# EAGLE design ESP32 UWB (EAGLE 6.6.0)
Assembly variants: No USB, Normal
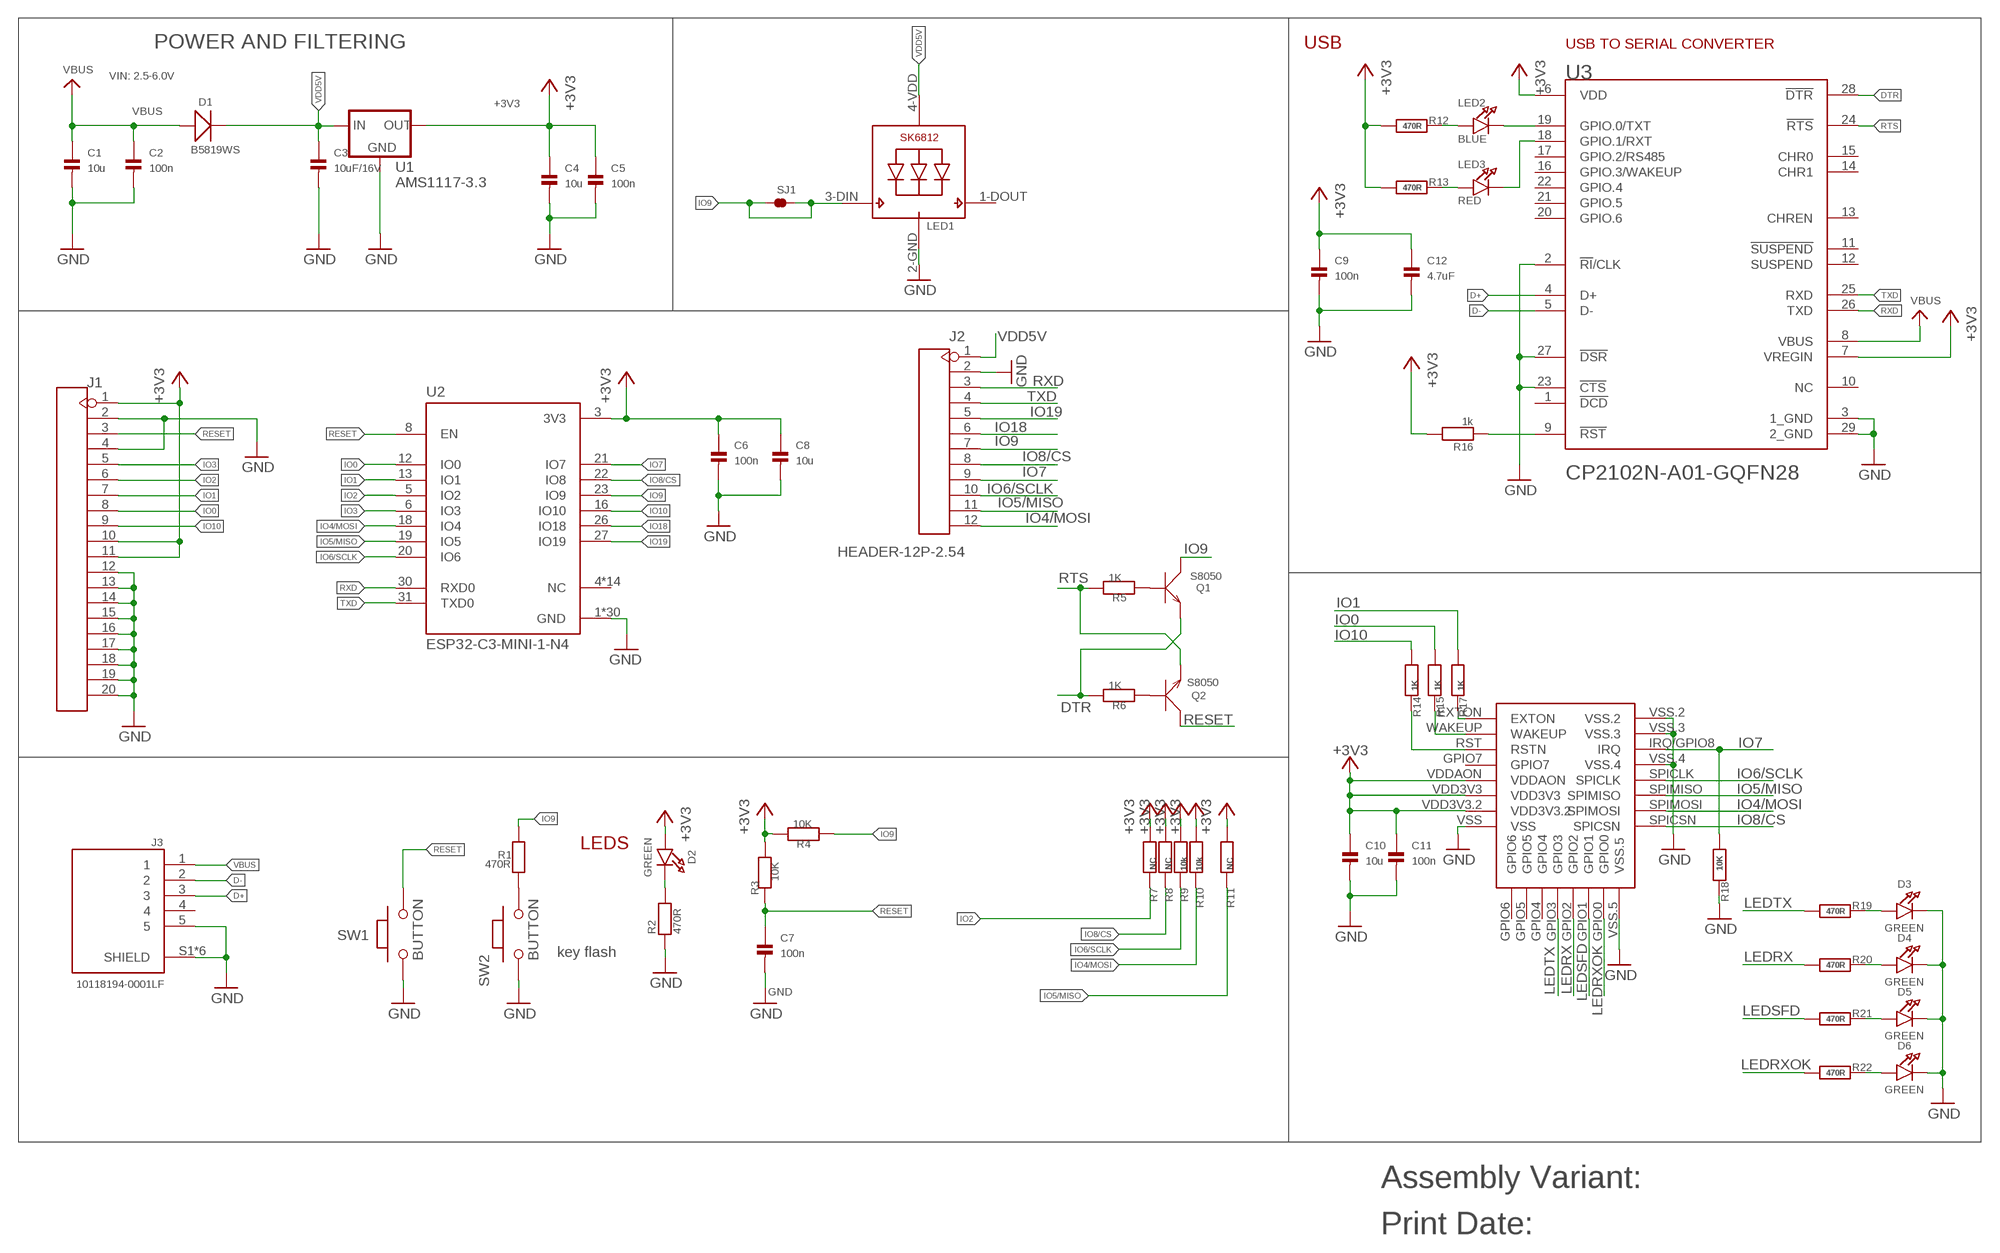
[diagram p0: schematic, sheet 1]

## Parts
C1  10u  CAP_CERAMIC0603  [0603]
C2  100n  CAP_CERAMIC0603  [0603]
C3  10uF/16V  CAP_CERAMIC0603  [0603]
C4  10u  CAP_CERAMIC0603  [0603]
C5  100n  CAP_CERAMIC0603  [0603]
C6  100n  CAP_CERAMIC0603  [0603]
C7  100n  CAP_CERAMIC0603  [0603]
C8  10u  CAP_CERAMIC0603  [0603]
C9  100n  CAP_CERAMIC0603  [0603]  (not fitted in variant No USB)
C10  10u  CAP_CERAMIC0603  [0603]
C11  100n  CAP_CERAMIC0603  [0603]
C12  4.7uF  CAP_CERAMIC0603  [0603]  (not fitted in variant No USB)
D1  B5819WS  D'0805'  [SOD323]
D2  GREEN  LED0805_NOOUTLINE  [CHIPLED_0805_NOOUTLINE]
D3  GREEN  LED0805_NOOUTLINE  [CHIPLED_0805_NOOUTLINE]
D4  GREEN  LED0805_NOOUTLINE  [CHIPLED_0805_NOOUTLINE]
D5  GREEN  LED0805_NOOUTLINE  [CHIPLED_0805_NOOUTLINE]
D6  GREEN  LED0805_NOOUTLINE  [CHIPLED_0805_NOOUTLINE]
J1  HEADER-20P-2.54  [20P-2.54]
J2  HEADER-12P-2.54  [12P-2.54]
J3  10118194-0001LF  [AMPHENOL_10118194-0001LF]
LED1  SK6812_3535  [LED3535]
LED2  BLUE  LED0603_NOOUTLINE  [CHIPLED_0603_NOOUTLINE]  (not fitted in variant No USB)
LED3  RED  LED0603_NOOUTLINE  [CHIPLED_0603_NOOUTLINE]  (not fitted in variant No USB)
Q1  S8050  TRANSISTOR-NPN-SOT23  [SOT23]  (not fitted in variant No USB)
Q2  S8050  TRANSISTOR-NPN-SOT23  [SOT23]  (not fitted in variant No USB)
R1  470R  RESISTOR0603  [0603]
R2  470R  RESISTOR0603  [0603]
R3  10K  RESISTOR0603  [0603]
R4  10K  RESISTOR0603  [0603]
R5  1K  RESISTOR0603  [0603]  (not fitted in variant No USB)
R6  1K  RESISTOR0603  [0603]  (not fitted in variant No USB)
R7  NC  RESISTOR0603  [0603]
R8  NC  RESISTOR0603  [0603]
R9  10k  RESISTOR0603  [0603]
R10  10k  RESISTOR0603  [0603]
R11  NC  RESISTOR0603  [0603]
R12  470R  RESISTOR0603  [0603]  (not fitted in variant No USB)
R13  470R  RESISTOR0603  [0603]  (not fitted in variant No USB)
R14  1K  RESISTOR0603  [0603]
R15  1K  RESISTOR0603  [0603]
R16  1k  RESISTOR0603  [0603]  (not fitted in variant No USB)
R17  1K  RESISTOR0603  [0603]
R18  10K  RESISTOR0603  [0603]
R19  470R  RESISTOR0603  [0603]
R20  470R  RESISTOR0603  [0603]
R21  470R  RESISTOR0603  [0603]
R22  470R  RESISTOR0603  [0603]
SJ1  SJS  [SJ_S]
SW1  BUTTON  PB157  [157SW]
SW2  BUTTON  PB157  [157SW]
U1  AMS1117-3.3  V_REG_MIC2920  [SOT223]
U2  ESP32-C3-MINI-1-N4  [XCVR_ESP32-C3-MINI-1-N4]
U3  SILICON_LABS_CP2102N-A01-GQFN28SILICON_LABS_CP2102N-A01-GQFN28_0_3  [SILICON_LABS_CP2102N-A01-GQFN28_3]  (not fitted in variant No USB)
U4  DWM1000  [DWM1000]

## Nets
+3V3: C4.1 C5.1 C6.1 C8.1 C9.1 C10.1 C11.1 C12.1 D2.A J1.1 J1.10 J1.11 R3.2 R4.2 R7.1 R8.1 R9.1 R10.1 R11.1 R12.1 R13.1 R16.2 U1.3(OUT) U2.3(3V3) U3.6(VDD) U3.7(VREGIN) U4.VDD3V3 U4.VDD3V3.2 U4.VDDAON
D+: J3.3 U3.4(D+)
D-: J3.2 U3.5(D-)
DTR: Q1.2(E) R6.2 U3.28(!DTR!)
GND: C1.2 C2.2 C3.2 C4.2 C5.2 C6.2 C7.2 C8.2 C9.2 C10.2 C11.2 C12.2 D3.C D4.C D5.C D6.C J1.2 J1.4 J1.12 J1.13 J1.14 J1.15 J1.16 J1.17 J1.18 J1.19 J1.20 J2.2 J3.5 J3.S1(SHIELD) J3.S2(SHIELD) J3.S3(SHIELD) J3.S4(SHIELD) J3.S5(SHIELD) J3.S6(SHIELD) LED1.2-GND(GND) R2.1 R18.2 SW1.1 SW2.1 U1.2(GND) U2.1(GND) U2.2(GND) U2.11(GND) U2.14(GND) U2.36(GND) U2.37(GND) U2.38(GND) U2.39(GND) U2.40(GND) U2.41(GND) U2.42(GND) U2.43(GND) U2.44(GND) U2.45(GND) U2.46(GND) U2.47(GND) U2.48(GND) U2.49_1(GND) U2.49_2(GND) U2.49_3(GND) U2.49_4(GND) U2.49_5(GND) U2.49_6(GND) U2.49_7(GND) U2.49_8(GND) U2.49_9(GND) U2.50(GND) U2.51(GND) U2.52(GND) U2.53(GND) U3.2(!RI!/CLK) U3.3(1_GND) U3.23(!CTS!) U3.27(!DSR!) U3.29(2_GND) U4.VSS U4.VSS.2 U4.VSS.3 U4.VSS.4 U4.VSS.5
IO0: J1.8 R15.1 U2.12(IO0)
IO1: J1.7 R17.1 U2.13(IO1)
IO2: J1.6 R7.2 U2.5(IO2)
IO3: J1.5 U2.6(IO3)
IO4/MOSI: J2.12 R10.2 U2.18(IO4) U4.SPIMOSI
IO5/MISO: J2.11 R11.2 U2.19(IO5) U4.SPIMISO
IO6/SCLK: J2.10 R9.2 U2.20(IO6) U4.SPICLK
IO7: J2.9 R18.1 U2.21(IO7) U4.IRQ/GPIO8(IRQ)
IO8/CS: J2.8 R8.2 U2.22(IO8) U4.SPICSN
IO9: J2.7 LED1.3-DIN(DI) Q1.3(C) R1.2 R4.1 SJ1.1 SJ1.2 U2.23(IO9)
IO10: J1.9 R14.1 U2.16(IO10)
IO18: J2.6 U2.26(IO18)
IO19: J2.5 U2.27(IO19)
LEDRX: R20.1 U4.GPIO2
LEDRXOK: R22.1 U4.GPIO0
LEDSFD: R21.1 U4.GPIO1
LEDTX: R19.1 U4.GPIO3
N$1: D3.A R19.2
N$2: LED2.A R12.2
N$3: LED2.C U3.19(GPIO.0/TXT)
N$4: LED3.A R13.2
N$5: D2.C R2.2
N$6: LED3.C U3.18(GPIO.1/RXT)
N$8: R16.1 U3.9(!RST!)
N$10: R17.2 U4.EXTON
N$11: R15.2 U4.WAKEUP
N$12: R14.2 U4.RST(RSTN)
N$13: Q2.1(B) R6.1
N$14: Q1.1(B) R5.1
N$15: R1.1 SW2.2
N$16: D4.A R20.2
N$17: D5.A R21.2
N$18: D6.A R22.2
RESET: C7.1 J1.3 Q2.3(C) R3.1 SW1.2 U2.8(EN)
RTS: Q2.2(E) R5.2 U3.24(!RTS!)
RXD: J2.3 U2.30(RXD0) U3.26(TXD)
TXD: J2.4 U2.31(TXD0) U3.25(RXD)
VBUS: C1.1 C2.1 D1.+ J3.1 U3.8(VBUS)
VDD5V: C3.1 D1.- J2.1 LED1.4-VDD(VDD) U1.1(IN)
Unconnected: J3.4 LED1.1-DOUT(DO) U2.4(NC) U2.7(NC) U2.9(NC) U2.10(NC) U2.15(NC) U2.17(NC) U2.24(NC) U2.25(NC) U2.28(NC) U2.29(NC) U2.32(NC) U2.33(NC) U2.34(NC) U2.35(NC) U3.1(!DCD!) U3.10(NC) U3.11(!SUSPEND!) U3.12(SUSPEND) U3.13(CHREN) U3.14(CHR1) U3.15(CHR0) U3.16(GPIO.3/WAKEUP) U3.17(GPIO.2/RS485) U3.20(GPIO.6) U3.21(GPIO.5) U3.22(GPIO.4) U4.GPIO4 U4.GPIO5 U4.GPIO6 U4.GPIO7

## Notes on the sheet
- POWER AND FILTERING
- USB | USB TO SERIAL CONVERTER
- VIN: 2.5-6.0V
- LEDS
- key flash
- Assembly Variant:
- Print Date:

## Library data of the parts
C1-C12 = isystems:CAP_CERAMIC: Ceramic Capacitors 0402 - 0402 Surface Mount Capacitors 16pF 50V 5% [Digikey: 445-4899-2-ND] 18pF 50V 5% [Digikey: 490-1281-2-ND] 22pF 50V 5% [Digikey: 490-1283-2-ND] 68pF 50V 5% [Digikey: 490-1289-2-ND] 0.1uF 10V 10% [Digikey: 490-1318-2-ND] 1.0uF 6.3V 10% [Digikey: 490-1320-2-ND] 0603 - 0603 Surface Mount Capacitors 16 pF 50V 5% [Digikey: 445-5051-2-ND] 22 pF 50V [Digikey: PCC220ACVTR-ND] 33 pF 50V 5% [Digikey: 490-1415-1-ND] 56pF 50V 5% [Digikey: 490-1421-1-ND] 220pF 50V 5% [Digikey: 445-1285-1-ND] 680 pF 50V 2200 pF 50V 5% C0G [Digikey: 445-1297-1-ND] 5600 pF 100V 5% X7R [Digikey: 478-3711-1-ND] 0.1 µF 25V 10% [Digikey: PCC2277TR-ND] 0.22 µF 16V 10% X7R [Digikey: 445-1318-1-ND] 1.0 µF 25V 10% [Digikey: 445-5146-2-ND] 0603 - RF Specific 3pF 250V +/-0.1pF RF [Digikey: 712-1347-1-ND] 18 pF 250V 5% [Digikey: 478-3505-1-ND or 712-1322-1-ND] 56 pF 250V 5% C0G RF [Digikey: 490-4867-1-ND] 68 pF 250V RF [Digikey: 490-4868-1-ND] 0805 - 0805 Surface Mount Capacitors 220 pF 250V 2% RF Ceramic Capacitor [Digikey: 712-1398-1-ND] 1000 pF 50V 2% NP0 Ceramic Capacitor [Digikey: 478-3760-1-ND] 0.1 µF 25V 10% Ceramic Capacitor [Digikey: PCC1828TR-ND] 1.0 µF 16V 10% Ceramic Capacitor[Digikey: 490-1691-2-ND] 10.0 µF 10V 10% Ceramic Capacitor[Digikey: 709-1228-1-ND] 10.0 uF 16V 10% Ceramic Capacitor [Digikey: 478-5165-2-ND] 47 uF 6.3V 20% Ceramic Capacitor [Digikey: 587-1779-1-ND or 399-5506-1-ND] 1206 - 1206 Surface Mount Capacitors 47uF 10V 20% Ceramic Capacitor [Digikey: 490-5528-1-ND or 399-5508-1-ND or 445-6010-1-ND] 100uF 6.3V -20%, +80% Y5V Ceramic Capacitor (Digikey: 490-4512-1-ND, Mouser: 81-GRM31CF50J107ZE1L)
D1 = Discrete:D*
D2-D6 = microbuilder:LED: LED
J1 = Connector:HEADER-20P
J2 = Connector:HEADER-12P
J3 = 10118194-0001LF:10118194-0001LF: Micro Usb, 2.0 Type b, Rcpt, Smt Check prices <https://pricing.snapeda.com/parts/10118194-0001LF/Amphenol%20ICC/view-part?ref=eda>; AVAILABILITY: In Stock; DESCRIPTION: Micro USB, Input Output Connectors, B TYPE RECEPTACLE with flange; MF: Amphenol ICC; MP: 10118194-0001LF; PACKAGE: None; PRICE: None; PURCHASE-URL: https://pricing.snapeda.com/search/part/10118194-0001LF/?ref=eda
LED1 = SK6812:SK6812
LED2 LED3 = isystems:LED: LED
Q1 Q2 = Discrete:TRANSISTOR-NPN*: NPN audion
R1-R22 = isystems:RESISTOR: Resistors 0402 - 0402 Surface Mount Package 22 Ohm 1% 1/16W [Digikey: 311-22.0LRTR-ND] 33 Ohm 5% 1/16W 1.0K 5% 1/16W 1.5K 5% 1/16W 2.0K 1% 1/16W 10.0K 1% 1/16W [Digikey: 311-10.0KLRTR-ND] 10.0K 5% 1/16W [Digikey: RMCF0402JT10K0TR-ND] 12.1K 1% 1/16W [Digikey: 311-22.0LRTR-ND] 100.0K 5% 1/16W 0603 - 0603 Surface Mount Package 0 Ohm 1/10 Watt 1% Resistor 15 Ohm 1/10 Watt 1% Resistor 33 Ohm 1/10 Watt 1% Resistor 49.9 Ohm 1/10 Watt 1% Resistor 100 Ohm 1/10 Watt 1% Resistor 150 Ohm 1/10 Watt 1% Resistor 240 Ohm 1/10 Watt 1% Resistor 390 Ohm 1/10 Watt 1% Resistor 560 Ohm 1/10 Watt 1% Resistor 680 Ohm 1/10 Watt 1% Resistor 750 Ohm 1/10 Watt 1% Resistor 1.0K Ohm 1/10 Watt 1% Resistor 1.5K Ohm 1/10 Watt 1% Resistor 2.0K Ohm 1/10 Watt 1% Resistor 2.2K Ohm 1/10 Watt 1% Resistor 3.3K Ohm 1/10 Watt 1% Resistor 4.7K Ohm 1/10 Watt 1% Resistor 10.0K Ohm 1/10 Watt 1% Resistor 12.0K Ohm 1/10 Watt 1% Resistor 12.1K Ohm 1/10 Watt 1% Resistor 20.0K Ohm 1/10 Watt 1% Resistor 33.0K Ohm 1/10 Watt 1% Resistor 100.0K Ohm 1/10 Watt 1% Resistor 0805 - 0805 Surface Mount Package 0 Ohm 1/8 Watt 1% Resistor 33 Ohm 1/8 Watt 1% Resistor 100 Ohm 1/8 Watt 1% Resistor 150 Ohm 1/8 Watt 1% Resistor 200 Ohm 1/8 Watt 1% Resistor 240 Ohm 1/8 Watt 1% Resistor 330 Ohm 1/8 Watt 1% Resistor 390 Ohm 1/8 Watt 1% Resistor 470 Ohm 1/8 Watt 1% Resistor 1.0K Ohm 1/8 Watt 1% Resistor 1.5K Ohm 1/8 Watt 1% Resistor 2.0K Ohm 1/8 Watt 1% Resistor 4.7K Ohm 1/8 Watt 1% Resistor 5.1K Ohm 1/8 Watt 1% Resistor 5.6K Ohm 1/8 Watt 1% Resistor 10.0K Ohm 1/8 Watt 1% Resistor 22.0K Ohm 1/8 Watt 1% Resistor 33.0K Ohm 1/8 Watt 1% Resistor 100K Ohm 1/8 Watt 1% Resistor 1206 - 1206 Surface Mount Package 2012 - 2010 Surface Mount Package 0.11 Ohm 1/2 Watt 1% Resistor - Digikey: RHM.11UCT-ND
SJ1 = isystems:SJ: SMD solder JUMPER
SW1 SW2 = MySMD:PB157
U1 = SparkFun-PowerIC:V_REG_MIC2920: MIC2920A (http://www.micrel.com/_PDF/mic2920.pdf) - 400mA output LDO Regulator
U2 = ESP32-C3-MINI-1-N4:ESP32-C3-MINI-1-N4: Check prices <https://pricing.snapeda.com/parts/ESP32-C3-MINI-1-N4/Espressif%20Systems/view-part?ref=eda>; AVAILABILITY: In Stock; DESCRIPTION: Bluetooth, WiFi 802.11b/g/n, Bluetooth v5.0 Transceiver Module 2.412GHz ~ 2.484GHz PCB Trace Surface Mount; MF: Espressif Systems; MP: ESP32-C3-MINI-1-N4; PACKAGE: SMD-53 Espressif Systems; PRICE: None; PURCHASE-URL: https://pricing.snapeda.com/search/part/ESP32-C3-MINI-1-N4/?ref=eda
U3 = Silicon Labs - CP2102N-A01-GQFN28:SILICON_LABS_CP2102N-A01-GQFN28: USB Bridge, USB to UART USB 2.0 UART Interface 28-QFN (5x5); AMBIENT_TEMPERATURE_RANGE_HIGH: +85°C; AMBIENT_TEMPERATURE_RANGE_LOW: -40°C; AUTOMOTIVE: No; CENTROID_NOT_SPECIFIED: No; DATASHEET: https://media.digikey.com/pdf/Data%20Sheets/Silicon%20Laboratories%20PDFs/CP2102N_Rev.1.3_DS.pdf; DEVICE_CLASS_L1: Integrated Circuits (ICs); DEVICE_CLASS_L2: Interface ICs; DEVICE_CLASS_L3: USB Interface ICs; DIGIKEY_DESCRIPTION: IC BRIDGE USB TO UART 28QFN; DIGIKEY_PART_NUMBER: 336-3694-ND; FOOTPRINT_PARAMETERS_1: {"fp_type":"QFN","params":{"N1":{"nom":7,"long name":"Leads on long side","min":null,"max":null,"short name":"N1","type":"count"},"N2":{"nom":7,"long name":"Leads on wide side","min":null,"max":null,"short name":"N2","type":"count"},"A":{"nom":750000,"long name":"Height","min":700000,"max":800000,"short name":"A","type":"measurement"},"A1":{"nom":false,"long name":"Package clearance","min":0,"max":50000,"short name":"A1","type":"measurement"},"A2":{"nom":false,"long name":"Package height","min":false,"max":750000,"short name":"A2","type":"measurement"},"D":{"nom":5000000,"long name":"Package length","min":4900000,"max":5100000,"short name":"D","type":"measurement"},"E":{"nom":5000000,"long name":"Package width","min":4900000,"max":5100000,"short name":"E","type":"measurement"},"B":{"nom":250000,"long name":"Lead width","min":200000,"max":300000,"short name":"B","type":"measurement"},"C":{"nom":200000,"long name":"Lead thickness","min":null,"max":null,"short name":"C","type":"measurement"},"L":{"nom":550000,"long name":"Lead foot length","min":450000,"max":650000,"short name":"L","type":"measurement"},"e":{"nom":500000,"long name":"Lead pitch","min":null,"max":null,"short name":"e","type":"measurement"},"D2":{"nom":3250000,"long name":"Thermal pad length","min":3150000,"max":false,"short name":"D2","type":"measurement"},"E2":{"nom":3250000,"long name":"Thermal pad width","min":3150000,"max":false,"short name":"E2","type":"measurement"},"PC":{"long name":"Paste coverage (%)","type":"percentage","short name":"PC","value":40},"HT":{"default":"Yes","long name":"Thermal pad","type":"multichoiceparent","short name":"HT","children":["D2","E2","PC"]},"offset x":{"nom":0,"long name":"X Center offset","min":null,"max":null,"short name":"offset x","type":"measurement"},"offset y":{"nom":0,"long name":"Y Center offset","min":null,"max":null,"short name":"offset y","type":"measurement"},"LS":{"default":"Rounded rectangle","long name":"Land shape","type":"multichoice","short name":"LS"},"LS1":{"default":"Rectangle","long name":"Land shape (Pin 1)","type":"multichoice","short name":"LS1"},"solder toe":{"nom":400000,"long name":"Solder fillet (toe)","min":null,"max":null,"short name":"solder toe","type":"fixedmeasurement"},"solder heel":{"nom":0,"long name":"Solder fillet (heel)","min":null,"max":null,"short name":"solder heel","type":"fixedmeasurement"},"solder side":{"nom":-40000,"long name":"Solder fillet (side)","min":null,"max":null,"short name":"solder side","type":"fixedmeasurement"},"courtyard":{"nom":500000,"long name":"Courtyard","min":null,"max":null,"short name":"courtyard","type":"fixedmeasurement"},"SF":{"default":"A","long name":"Packing level","type":"multichoiceparent","short name":"SF","help":"http://support.upverter.com/customer/portal/articles/978783-what-is-a-footprint-packing-level","children":["solder toe","solder heel","solder side","courtyard"]}}}; FOOTPRINT_PARAMETERS_2: {"fp_type":"QFN","params":{"N1":{"nom":7,"long name":"Leads on long side","min":null,"max":null,"short name":"N1","type":"count"},"N2":{"nom":7,"long name":"Leads on wide side","min":null,"max":null,"short name":"N2","type":"count"},"A":{"nom":750000,"long name":"Height","min":700000,"max":800000,"short name":"A","type":"measurement"},"A1":{"nom":false,"long name":"Package clearance","min":0,"max":50000,"short name":"A1","type":"measurement"},"A2":{"nom":false,"long name":"Package height","min":false,"max":750000,"short name":"A2","type":"measurement"},"D":{"nom":5000000,"long name":"Package length","min":4900000,"max":5100000,"short name":"D","type":"measurement"},"E":{"nom":5000000,"long name":"Package width","min":4900000,"max":5100000,"short name":"E","type":"measurement"},"B":{"nom":250000,"long name":"Lead width","min":200000,"max":300000,"short name":"B","type":"measurement"},"C":{"nom":200000,"long name":"Lead thickness","min":null,"max":null,"short name":"C","type":"measurement"},"L":{"nom":550000,"long name":"Lead foot length","min":450000,"max":650000,"short name":"L","type":"measurement"},"e":{"nom":500000,"long name":"Lead pitch","min":null,"max":null,"short name":"e","type":"measurement"},"D2":{"nom":3250000,"long name":"Thermal pad length","min":3150000,"max":false,"short name":"D2","type":"measurement"},"E2":{"nom":3250000,"long name":"Thermal pad width","min":3150000,"max":false,"short name":"E2","type":"measurement"},"PC":{"long name":"Paste coverage (%)","type":"percentage","short name":"PC","value":40},"HT":{"default":"Yes","long name":"Thermal pad","type":"multichoiceparent","short name":"HT","children":["D2","E2","PC"]},"offset x":{"nom":0,"long name":"X Center offset","min":null,"max":null,"short name":"offset x","type":"measurement"},"offset y":{"nom":0,"long name":"Y Center offset","min":null,"max":null,"short name":"offset y","type":"measurement"},"LS":{"default":"Rounded rectangle","long name":"Land shape","type":"multichoice","short name":"LS"},"LS1":{"default":"Rectangle","long name":"Land shape (Pin 1)","type":"multichoice","short name":"LS1"},"solder toe":{"nom":300000,"long name":"Solder fillet (toe)","min":null,"max":null,"short name":"solder toe","type":"fixedmeasurement"},"solder heel":{"nom":0,"long name":"Solder fillet (heel)","min":null,"max":null,"short name":"solder heel","type":"fixedmeasurement"},"solder side":{"nom":-40000,"long name":"Solder fillet (side)","min":null,"max":null,"short name":"solder side","type":"fixedmeasurement"},"courtyard":{"nom":250000,"long name":"Courtyard","min":null,"max":null,"short name":"courtyard","type":"fixedmeasurement"},"SF":{"default":"B","long name":"Packing level","type":"multichoiceparent","short name":"SF","help":"http://support.upverter.com/customer/portal/articles/978783-what-is-a-footprint-packing-level","children":["solder toe","solder heel","solder side","courtyard"]}}}; FOOTPRINT_PARAMETERS_3: {"fp_type":"QFN","params":{"N1":{"nom":7,"long name":"Leads on long side","min":null,"max":null,"short name":"N1","type":"count"},"N2":{"nom":7,"long name":"Leads on wide side","min":null,"max":null,"short name":"N2","type":"count"},"A":{"nom":750000,"long name":"Height","min":700000,"max":800000,"short name":"A","type":"measurement"},"A1":{"nom":false,"long name":"Package clearance","min":0,"max":50000,"short name":"A1","type":"measurement"},"A2":{"nom":false,"long name":"Package height","min":false,"max":750000,"short name":"A2","type":"measurement"},"D":{"nom":5000000,"long name":"Package length","min":4900000,"max":5100000,"short name":"D","type":"measurement"},"E":{"nom":5000000,"long name":"Package width","min":4900000,"max":5100000,"short name":"E","type":"measurement"},"B":{"nom":250000,"long name":"Lead width","min":200000,"max":300000,"short name":"B","type":"measurement"},"C":{"nom":200000,"long name":"Lead thickness","min":null,"max":null,"short name":"C","type":"measurement"},"L":{"nom":550000,"long name":"Lead foot length","min":450000,"max":650000,"short name":"L","type":"measurement"},"e":{"nom":500000,"long name":"Lead pitch","min":null,"max":null,"short name":"e","type":"measurement"},"D2":{"nom":3250000,"long name":"Thermal pad length","min":3150000,"max":false,"short name":"D2","type":"measurement"},"E2":{"nom":3250000,"long name":"Thermal pad width","min":3150000,"max":false,"short name":"E2","type":"measurement"},"PC":{"long name":"Paste coverage (%)","type":"percentage","short name":"PC","value":40},"HT":{"default":"Yes","long name":"Thermal pad","type":"multichoiceparent","short name":"HT","children":["D2","E2","PC"]},"offset x":{"nom":0,"long name":"X Center offset","min":null,"max":null,"short name":"offset x","type":"measurement"},"offset y":{"nom":0,"long name":"Y Center offset","min":null,"max":null,"short name":"offset y","type":"measurement"},"LS":{"default":"Rounded rectangle","long name":"Land shape","type":"multichoice","short name":"LS"},"LS1":{"default":"Rectangle","long name":"Land shape (Pin 1)","type":"multichoice","short name":"LS1"},"solder toe":{"nom":200000,"long name":"Solder fillet (toe)","min":null,"max":null,"short name":"solder toe","type":"fixedmeasurement"},"solder heel":{"nom":0,"long name":"Solder fillet (heel)","min":null,"max":null,"short name":"solder heel","type":"fixedmeasurement"},"solder side":{"nom":-40000,"long name":"Solder fillet (side)","min":null,"max":null,"short name":"solder side","type":"fixedmeasurement"},"courtyard":{"nom":100000,"long name":"Courtyard","min":null,"max":null,"short name":"courtyard","type":"fixedmeasurement"},"SF":{"default":"C","long name":"Packing level","type":"multichoiceparent","short name":"SF","help":"http://support.upverter.com/customer/portal/articles/978783-what-is-a-footprint-packing-level","children":["solder toe","solder heel","solder side","courtyard"]}}}; FOOTPRINT_VARIANT_NAME_0: Recommended_Land_Pattern; FOOTPRINT_VARIANT_NAME_1: IPC_A; FOOTPRINT_VARIANT_NAME_2: IPC_B; FOOTPRINT_VARIANT_NAME_3: IPC_C; HEIGHT: 0.8mm; INTERFACE: UART,USB,RS-232,RS-485; IPC_LAND_PATTERN_NAME: QFN50P500X500X75-28; LEAD_FREE: Yes; MAX_JUNCTION_TEMP: +105°C; MAX_SUPPLY_VOLTAGE: 5.25V; MF: Silicon Labs; MFG_PACKAGE_IDENT: CP2102N-A01-GQFN28; MFG_PACKAGE_IDENT_DATE: 0; MFG_PACKAGE_IDENT_REV: 0; MIN_SUPPLY_VOLTAGE: 1.71V; MOUSER_DESCRIPTION: IC BRIDGE USB TO UART 28QFN; MOUSER_PART_NUMBER: 634-CP2102NA01GQFN28; MPN: CP2102N-A01-GQFN28; NOMINAL_SUPPLY_CURRENT: 195-13700uA; NUMBER_OF_PORTS: 1; PACKAGE: QFN28; PREFIX: U; ROHS: Yes; STANDOFF_HEIGHT: 0mm; TEMPERATURE_RANGE_HIGH: +85°C; TEMPERATURE_RANGE_LOW: -40°C; USB_STANDARD: USB 2.0; VERIFICATION_VERSION: 0.0.0.3
U4 = DWM1000:DWM1000

## Net classes
0 default: drill 0.3 mm, clearance 0.152 mm

## Board
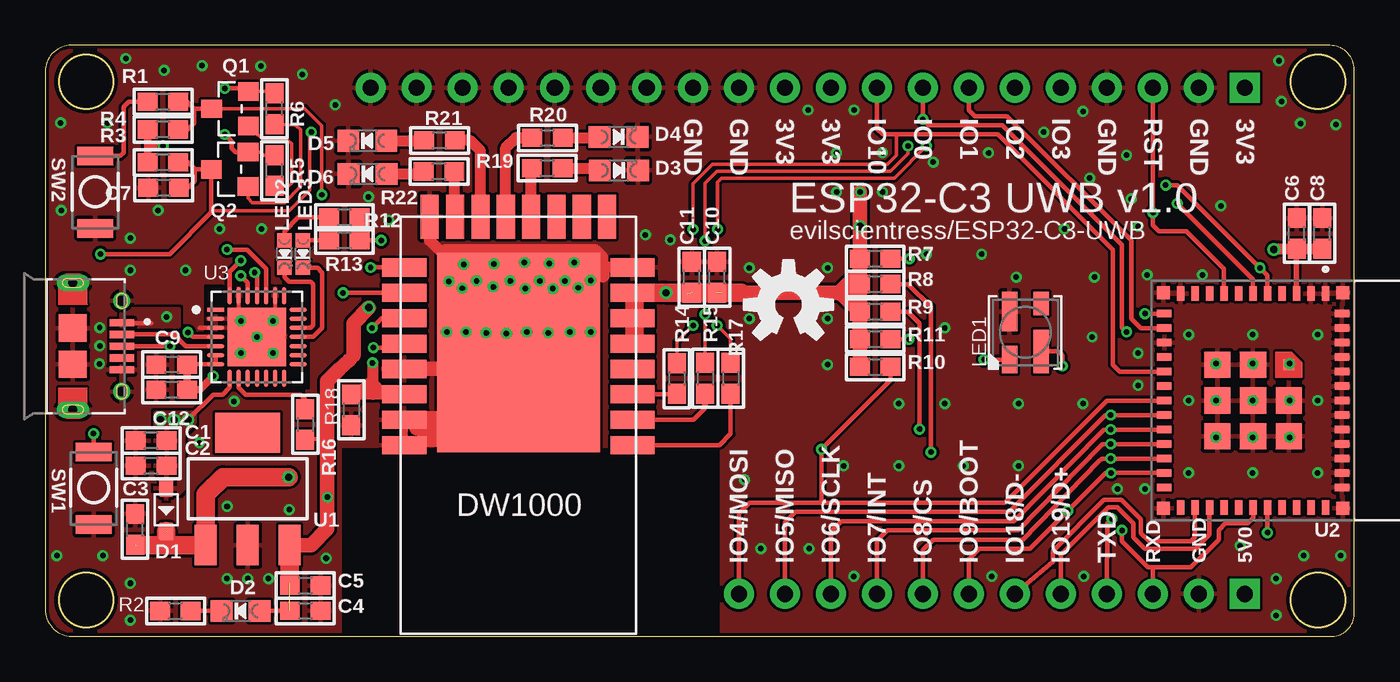
[diagram p1: board, top side]
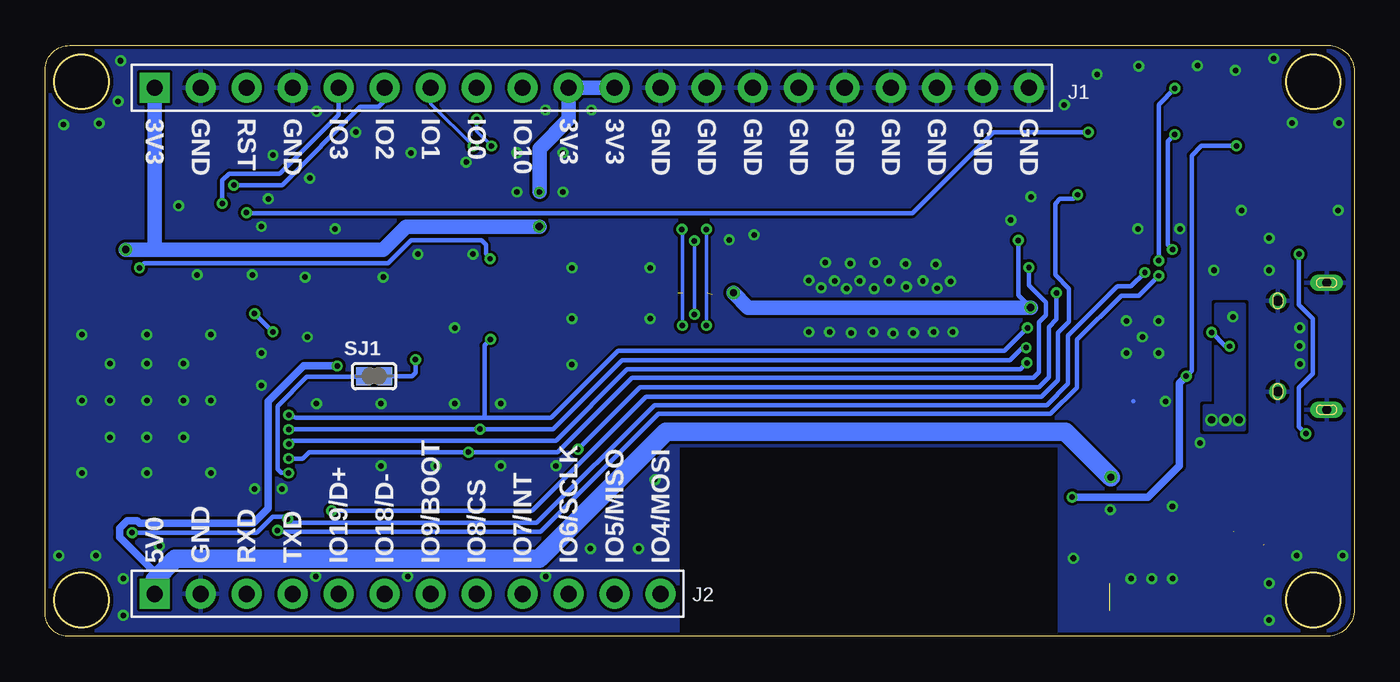
[diagram p2: board, bottom side, seen from below]

Size 72.25 x 32.61 mm. Coordinates in mm from the lower left corner, seen from the top.
Outline: 1.6,0.01 71.03,0.01 arc90 72.25,1.23 72.25,31.27 arc90 70.92,32.61 1.57,32.61 arc90 0,31.28 0,1.36 arc90 1.6,0.01
Outline: circle at 2.25,2.01 radius 1.5
Outline: circle at 2.25,30.61 radius 1.5
Outline: circle at 70.25,30.61 radius 1.5
Outline: circle at 70.25,2.01 radius 1.5
Copper layers (1*16): Top 0.035mm / dielectric 1.5mm / Bottom 0.035mm
Design rules "JLCPCB_2-layer_035um-cu *": minimum track width 5mil, minimum drill 0.3mm, track to track 5mil, track to pad 0.2mm, pad to pad 0.15mm, via to via 0.15mm, smd to smd 0.15mm, copper to edge 0.2mm, drill to drill 10mil, minimum pad ring 0.2mm, minimum via ring 0.15mm, stop-mask expansion 0.05mm, vias tented up to drill 0mil, thermal gap 0.2mm
tRestrict: area 16.4,0 to 37.2,10.4
bRestrict: area 16.4,0 to 37.2,10.4

### Footprints (pad centres in the part's own frame; a part is rotated, then mirrored left to right if it is on the bottom)
0603 = smd 1.1 x 1: 1 -0.85,0; 2 0.85,0
SOD323 = smd 1 x 0.8: + -1.2,0; - 1.2,0
CHIPLED_0805_NOOUTLINE = smd 1.2 x 1.2: A 0,-1.05; C 0,1.05
20P-2.54 = drill 0.889 pad 1.651 square: 1 -25.4,0 | drill 0.889 pad 1.651: 2 -22.86,0; 3 -20.32,0; 4 -17.78,0; 5 -15.24,0; 6 -12.7,0; 7 -10.16,0; 8 -7.62,0; 9 -5.08,0; 10 -2.54,0; 11 0,0; 12 2.54,0; 13 5.08,0; 14 7.62,0; 15 10.16,0; 16 12.7,0; 17 15.24,0; 18 17.78,0; 19 20.32,0; 20 22.86,0
12P-2.54 = drill 0.889 pad 1.651 square: 1 0,13.97 | drill 0.889 pad 1.651: 2 0,11.43; 3 0,8.89; 4 0,6.35; 5 0,3.81; 6 0,1.27; 7 0,-1.27; 8 0,-3.81; 9 0,-6.35; 10 0,-8.89; 11 0,-11.43; 12 0,-13.97
AMPHENOL_10118194-0001LF = smd 0.4 x 1.35: 1 -1.3,2.7; 2 -0.65,2.7; 3 0,2.7; 4 0.65,2.7; 5 1.3,2.7 | drill 0.55 pad 0.775: S1 -2.5,2.7; S2 2.5,2.7 | drill 0.5 pad 0.775 long: S3 -3.5,0; S6 3.5,0 | smd 1.5 x 1.55: S4 -1,0; S5 1,0
LED3535 = smd 1.3 x 0.85: 1-DOUT 1.6,-0.875 | smd 2.2 x 0.85: 2-GND 1.15,0.875 | smd 1.5 x 0.85: 3-DIN -1.5,0.875 | smd 2.4 x 0.85: 4-VDD -1.05,-0.875
CHIPLED_0603_NOOUTLINE = smd 0.8 x 0.8: A 0,-0.75; C 0,0.75
SOT23 = smd 1.016 x 1.143: 1 -0.95,-1.016; 2 0.95,-1.016; 3 0,1.016
SJ_S = smd 0.8 x 1: 1 -0.6,0; 2 0.6,0
157SW = smd 1.016 x 1.981: 1 0,0; 2 4,0
SOT223 = smd 1.219 x 2.235: 1 -2.311,-3.099; 2 0,-3.099; 3 2.311,-3.099 | smd 3.6 x 2.2: 4 0,3.099
XCVR_ESP32-C3-MINI-1-N4 = smd 0.8 x 0.4: 1 -5.9,1.3; 2 -5.9,0.5; 3 -5.9,-0.3; 4 -5.9,-1.1; 5 -5.9,-1.9; 6 -5.9,-2.7; 7 -5.9,-3.5; 8 -5.9,-4.3; 9 -5.9,-5.1; 10 -5.9,-5.9; 11 -5.9,-6.7; 25 5.9,-6.7; 26 5.9,-5.9; 27 5.9,-5.1; 28 5.9,-4.3; 29 5.9,-3.5; 30 5.9,-2.7; 31 5.9,-1.9; 32 5.9,-1.1; 33 5.9,-0.3; 34 5.9,0.5; 35 5.9,1.3 | smd 0.4 x 0.8: 12 -4.8,-7.6; 13 -4,-7.6; 14 -3.2,-7.6; 15 -2.4,-7.6; 16 -1.6,-7.6; 17 -0.8,-7.6; 18 0,-7.6; 19 0.8,-7.6; 20 1.6,-7.6; 21 2.4,-7.6; 22 3.2,-7.6; 23 4,-7.6; 24 4.8,-7.6; 36 4.8,2.2; 37 4,2.2; 38 3.2,2.2; 39 2.4,2.2; 40 1.6,2.2; 41 0.8,2.2; 42 0,2.2; 43 -0.8,2.2; 44 -1.6,2.2; 45 -2.4,2.2; 46 -3.2,2.2; 47 -4,2.2; 48 -4.8,2.2 | smd 0.6 x 0.6: 49_1 -1.975,-0.725 | smd 1.45 x 1.45: 49_2 0,-0.725; 49_3 1.975,-0.725; 49_4 1.975,-2.7; 49_5 1.975,-4.675; 49_6 0,-4.675; 49_7 -1.975,-4.675; 49_8 -1.975,-2.7; 49_9 0,-2.7 | smd 0.7 x 0.7: 50 5.95,2.25; 51 5.95,-7.65; 52 -5.95,-7.65; 53 -5.95,2.25
SILICON_LABS_CP2102N-A01-GQFN28_3 = smd 0.96 x 0.242: 1 -2.276,1.5; 2 -2.276,1; 3 -2.276,0.5; 4 -2.276,0; 5 -2.276,-0.5; 6 -2.276,-1; 7 -2.276,-1.5; 15 2.276,-1.5; 16 2.276,-1; 17 2.276,-0.5; 18 2.276,0; 19 2.276,0.5; 20 2.276,1; 21 2.276,1.5 | smd 0.242 x 0.96: 8 -1.5,-2.276; 9 -1,-2.276; 10 -0.5,-2.276; 11 0,-2.276; 12 0.5,-2.276; 13 1,-2.276; 14 1.5,-2.276; 22 1.5,2.276; 23 1,2.276; 24 0.5,2.276; 25 0,2.276; 26 -0.5,2.276; 27 -1,2.276; 28 -1.5,2.276 | smd 3.25 x 3.25: 29 0,0
DWM1000 = smd 2.45 x 1: EXTON -2.8,12.6; GPIO7 -2.8,8.4; IRQ/GPIO8 9.8,9.8; RST -2.8,9.8; SPICLK 9.8,7; SPICSN 9.8,2.8; SPIMISO 9.8,5.6; SPIMOSI 9.8,4.2; VDD3V3 -2.8,4.2; VDD3V3.2 -2.8,5.6; VDDAON -2.8,7; VSS -2.8,2.8; VSS.2 9.8,12.6; VSS.3 9.8,11.2; VSS.4 9.8,8.4; WAKEUP -2.8,11.2 | smd 9 x 11: GND 3.5,7.5 | smd 1 x 2.45: GPIO0 7,0; GPIO1 5.6,0; GPIO2 4.2,0; GPIO3 2.8,0; GPIO4 1.4,0; GPIO5 0,0; GPIO6 -1.4,0; VSS.5 8.4,0

### Placement (x,y rotation side)
C1  5.84,10.8 180 top
C2  5.84,9.4 180 top
C3  4.95,5.9 90 top
C4  14.35,1.4 0 top
C5  14.35,2.8 0 top
C6  69.09,22.23 90 top
C7  6.53,24.75 180 top
C8  70.48,22.23 90 top
C9  6.98,14.99 180 top
C10  37.08,19.82 90 top
C11  35.69,19.82 90 top
C12  6.98,13.59 180 top
D1  6.67,6.98 270 top
D2  10.79,1.4 90 top
D3  31.66,25.71 270 top
D4  31.65,27.55 270 top
D5  17.78,27.35 90 top
D6  17.8,25.51 90 top
J1  40.82,30.28 0 bottom
J2  52.25,2.34 90 bottom
J3  1.52,16.01 270 top
LED1  54.1,16.77 90 top
LED2  13.21,21.09 180 top
LED3  14.22,21.09 180 top
Q1  10.2,29.11 90 top
Q2  10.18,25.76 90 top
R1  6.5,29.5 0 top
R2  7.19,1.4 0 top
R3  6.5,26.15 180 top
R4  6.5,27.97 180 top
R5  12.65,25.7 90 top
R6  12.65,29.11 90 top
R7  45.81,20.83 0 top
R8  45.81,19.44 0 top
R9  45.81,17.91 0 top
R10  45.81,14.86 0 top
R11  45.81,16.39 0 top
R12  16.51,23.12 180 top
R13  16.51,21.85 180 top
R14  34.86,14.22 270 top
R15  36.43,14.24 270 top
R16  14.35,11.69 270 top
R17  37.83,14.24 270 top
R18  16.89,12.49 270 top
R19  27.71,25.83 0 top
R20  27.72,27.5 0 top
R21  21.76,27.36 180 top
R22  21.73,25.64 180 top
SJ1  54.1,14.36 0 bottom
SW1  2.67,6.16 90 top
SW2  2.75,22.51 90 top
U1  11.18,8.13 0 top
U2  69.37,13.01 270 top
U3  11.68,16.52 0 top
U4  29.62,23.15 180 top
U$1  [OSHW-LOGO-M]  41.02,18.29 0 top

### Tracks (layer width: path | path; a pad name or v marks a point on that pad's centre or on a via)
+3V3  (via drill 0.3, 0.4)  (5 unrouted)
  Top 0.254: 34.27,18.87 34.34,18.95 | 44.85,19.26 R9.1 | U3.6 U3.7 7.84,15.02 C9.1 | R16.2 15.57,10.93 | D2.A 13.48,1.4 | v18.54,21.85 R13.1 R12.1 | 69.07,21.14 69.09,21.16 C6.1
  Top 0.305: U2.3 69.07,21.14
  Top 0.406: U4.VDD3V3.2 U4.VDDAON | v6.5,27.06 5.65,27.06 | 5.65,27.06 R4.2 | v9.27,14.36 8.51,13.59 C12.1 C9.1 | R3.2 5.65,27.06
  Top 0.61: v67.82,21.34 67.86,21.38 C6.1 C8.1
  Top 0.813: U4.VDD3V3.2 U4.VDD3V3 | 35.45,18.87 34.27,18.87 32.64,18.87 32.56,18.95 v34.27,18.95 | 37.31,18.95 38.41,18.95 43.89,18.95 | 43.89,18.95 44.77,18.95 R9.1 44.96,19.4 R11.1 44.95,18.37 R8.1 44.93,16.12 R7.1 | 44.85,19.26 44.98,19.19 R10.1 44.98,20.72 v44.98,22.61 v44.98,24.52 | v17.86,18.14 17.02,17.28 17.02,15.5 16.76,15.25 16.23,14.74 15.57,14.08 15.57,10.93 v15.57,7.68 15.57,5.92 14.68,5.03 U1.3 | 43.89,18.95 R9.1 44.93,20.07 | 44.93,20.48 44.93,20.07 | 44.93,20.07 43.79,18.93
  Top 1.016: 32.49,16.2 32.49,16.19 arc90 32.51,16.16 32.53,16.16 32.53,18.84 arc90 U4.VDD3V3 34.34,18.95 38.4,18.95 38.41,18.95 | U1.3 13.49,2.92
  Bottom 0.254: v6.5,27.06 8.43,27.06 8.97,26.52 8.97,14.66 v9.27,14.36 | v17.86,18.14 18.54,18.83 v18.54,21.85
  Bottom 0.406: v9.27,14.36 9.65,13.98 9.65,9.4 11.38,7.68 v15.57,7.68
  Bottom 0.813: 66.22,21.34 53.59,21.34 52.32,22.61 v44.98,22.61 | v17.86,18.14 33.45,18.14 v34.27,18.95 | 66.22,21.34 J1.1 | 66.22,21.34 v67.82,21.34 | J1.11 J1.10 43.36,28.52 44.98,26.9 v44.98,24.52
D+  (via drill 0.3)
  Top 0.254: U3.4 8.13,16.52 v7.87,16.77 | v6.88,16.01 4.48,16.01 arc-90 J3.3
  Bottom 0.254: v7.87,16.77 7.11,16.01 v6.88,16.01
D-
  Top 0.254: U3.5 7.74,16.02 7.1,16.66 J3.2
DTR  (via drill 0.3)
  Top 0.2: R6.2 12.43,30.01 12.23,30.06 Q1.2
  Top 0.254: U3.28 10.18,20.12 v10.79,20.73 | v9.91,30.23 11.04,30.23 Q1.2
  Bottom 0.254: v10.79,20.73 10.79,29.34 v9.91,30.23
GND  (via drill 0.3)
  Top 0.2: U3.27 10.68,17.4 v10.79,17.4 | U3.23 12.68,17.4 v12.57,17.4
  Top 0.254: v30.11,19.64 30.11,19.75 30.68,20.33 | U3.3 8.51,17.02
  Top 0.406: U4.VSS.3 U4.VSS.2
  Top 0.61: U4.VSS 22.71,20.35 21.21,21.85 U4.VSS.5
  Top 0.813: U4.VSS.4 23.03,14.75 23.88,13.9 23.88,12.43 23.39,11.94 19.83,11.94 U4.VSS.3 | 22.12,21.24 30.33,21.24 30.68,20.88 30.68,20.33 30.68,20 30.76,19.92 | 20.85,10.85 22.02,10.85 22.05,10.88 22.05,11.49 20.5,11.49 20.5,11.69 20.85,12.05 21.87,12.05
  Bottom 0.254: 12.18,12.97 12.19,12.96
  other vias: 14.19,31.01 3.01,16.03 2.99,15.03 8.66,31.49 11.9,31.46 6.55,31.22 66.65,13.01 49.66,17.02 69.28,28.31 47.12,9.4 71.24,28.24 68.1,31.76 17.84,24.25 16.01,29.32 18.95,22.97 15.5,4.31 3,17.03 23.1,20.53 24.77,20.55 26.45,20.63 27.82,20.58 29.19,20.63 23.81,19.61 25.66,19.61 27.29,19.61 28.68,19.61 22.28,19.59 33.13,22.15 23.22,16.79 24.34,16.74 26.57,16.79 28.96,16.79 30.11,16.79 27.77,16.74 25.46,16.72 22.16,16.79 24.72,19.28 23.02,19.21 26.5,19.18 28.02,19.18 29.42,19.23 10.04,7.17 13.47,6.99 9.62,22.48 0.84,28.33 34.5,21.87 49.66,12.83 50.67,9.4 68.23,29.52 56.26,22.48 59.94,24.14 44.64,29.04 42.1,29.04 43.68,26.68 46.22,26.68 46.22,24.52 43.68,24.52 55.12,27.82 57.66,25.28 57.28,28.96 59.69,26.55 47.12,12.83 57.28,12.83 53.72,9.4 53.72,12.83 44.07,9.4 43.18,17.53 43.18,14.99 38.86,17.53 38.86,20.33 43.18,20.33 51.69,21.09 53.59,19.82 57.91,19.82 48.64,21.09 64.62,13.01 68.68,13.01 68.68,15.04 66.65,15.04 64.62,15.04 64.62,10.98 66.65,10.98 68.68,10.98 63.12,16.64 70.23,16.64 70.23,9.02 63.12,9.02 63.12,13.01 70.23,13.01 66.65,16.64 66.65,9.02 60.32,13.85 60.32,15.63 60.83,19.94 60.32,22.61 63.88,19.94 42.16,4.83 39.5,4.83 38.61,8.64 52.25,3.31 57.33,3.31 44.63,3.31 11.68,16.52 12.57,15.63 10.79,15.63 8.51,10.67 11.18,3.18 10.03,3.18 12.32,3.18 11.94,22.48 6.22,23.5 0.89,23.5 4.7,21.98 4.7,20.2 7.75,20.2 10.41,12.96 60.71,8.13 65.96,4.98 71.5,4.45 69.47,4.45 52.07,26.68 64.9,23.75 67.95,3.18 67.95,1.15 0.64,4.45 3.17,4.45 4.7,2.93 4.7,0.89 4.45,31.88 3.43,28.33 49.02,26.17 59.18,8.13 57.78,16.52
  pour Top (rank 3): -8.26,37.36 75.7,37.36 75.7,-3.16 -8.26,-3.16 -8.26,37.36
  pour Bottom (rank 3): -2.29,35.57 76.45,35.57 76.45,-2.53 -2.29,-2.53
IO0  (via drill 0.3)
  Top 0.2: v36.42,17.76 R15.1 | v36.42,21.82 36.42,25.01 37.08,25.67 46.66,25.67 47.62,26.64 v47.62,27.06
  Top 0.254: v59.69,16.79 59.66,16.79 59.44,17.02 59.44,21.6 52.83,28.2 48.77,28.2 v48.44,28.52 J1.8 | v60.71,17.81 U2.12
  Bottom 0.2: v36.42,17.76 v36.42,21.82 | v47.62,27.06 48.44,27.88 v48.44,28.52
  Bottom 0.254: v59.69,16.79 v60.71,17.81
IO1  (via drill 0.3)
  Top 0.2: v37.11,22.46 37.11,25.05 37.34,25.28 46.86,25.28 v48.64,27.06 | v37.08,17.15 37.83,16.4 R17.1
  Top 0.254: U2.13 60.46,17.01 59.94,17.53 59.94,21.85 53.09,28.71 51.31,28.71 50.98,29.03 J1.7
  Bottom 0.2: v37.08,17.15 37.08,22.43 | v48.64,27.06 50.98,29.4 J1.7
  Bottom 0.254: 37.08,22.43 v37.11,22.46
IO2  (via drill 0.3)
  Top 0.254: U2.5 67.47,19.91 v67.06,20.33 62.48,24.9 v61.85,24.9 | R7.2 v47.7,20.83
  Bottom 0.254: v61.85,24.9 59.18,24.9 54.86,29.22 53.85,29.22 53.52,29.54 J1.6 | v47.7,20.83 47.93,21.11 47.93,21.6 48.18,21.85 52.07,21.85 53.34,20.58 66.8,20.58 v67.06,20.33
IO3  (via drill 0.3)
  Top 0.254: U2.6 66.67,19.7 v62.48,23.88
  Bottom 0.254: v62.48,23.88 62.48,25.15 62.1,25.53 59.31,25.53 56.06,28.78 J1.5
IO4/MOSI  (via drill 0.3)
  Top 0.254: U4.SPIMOSI 16.69,18.95 v16.43,18.95 | U2.18 58.6,13.01 52.96,7.37 42.8,7.37 | 42.8,7.37 38.86,7.37 38.28,6.79 J2.12 | 42.8,7.37 42.85,7.42 v42.85,10.32 46.66,14.13 R10.2 46.7,14.75
  Bottom 0.254: v42.85,10.32 39.42,13.75 17.4,13.75 16.87,14.28 16.87,17.05 16.43,17.48 v16.43,18.95
IO5/MISO  (via drill 0.3)
  Top 0.254: U2.19 v58.81,12.21 58.53,12.21 58.52,12.2 53.21,6.86 41.4,6.86 40.82,6.29 J2.11 | U4.SPIMISO 18.56,17.55 v18.03,17.02 | R11.2 v47.68,16.39
  Bottom 0.254: v18.03,17.02 19.3,15.75 40.64,15.75 44.32,12.07 48.01,12.07 | 48.01,12.07 58.42,12.07 v58.81,12.21 | v47.68,16.39 48.01,16.06 48.01,12.07
IO6/SCLK  (via drill 0.3)
  Top 0.254: U2.20 v58.81,11.41 58.45,11.41 58.29,11.26 53.47,6.36 43.94,6.36 43.36,5.78 J2.10 | U4.SPICLK 19.6,15.93 v18.11,15.93 | R9.2 47.62,17.91 48.26,17.28 v48.26,11.44
  Bottom 0.254: v18.11,15.93 18.31,15.93 19,15.25 40.41,15.25 44.22,11.44 v48.26,11.44 58.5,11.44 v58.81,11.41
IO7  (via drill 0.3)
  Top 0.254: U2.21 v58.81,10.61 58.36,10.61 58.22,10.47 53.72,5.85 46.48,5.85 45.9,5.27 J2.9
  Top 0.61: U4.IRQ/GPIO8 18.09,13.35 | 18.09,13.35 R18.1 | v18.06,15.09 18.06,14.15 | 18.06,13.95 18.06,13.38 18.09,13.35 | 17.42,13.39 17.42,13.52 18.06,14.15 | 18.06,14.15 18.06,13.95 | 18.06,13.95 18.59,13.42
  Bottom 0.254: v18.06,15.09 18.42,14.74 40.13,14.74 44.07,10.8 58.62,10.8 v58.81,10.61
IO8/CS  (via drill 0.3)
  Top 0.254: U2.22 v58.81,9.81 58.32,9.81 58.17,9.66 53.97,5.34 49.02,5.34 48.44,4.76 J2.8 | U4.SPICSN v17.96,20.35 | R8.2 47.62,19.44 48.89,18.19 v48.89,10.17
  Bottom 0.254: v17.96,20.35 17.96,19.36 17.02,18.42 17.02,17.71 17.4,17.33 17.4,14.56 17.7,14.25 39.88,14.25 43.97,10.17 v48.89,10.17 57.68,10.17 58.04,9.81 v58.81,9.81
IO9  (via drill 0.3, 0.3 pad 0.25)
  Top 0.2: v15.26,24.36 15.26,28.17 14.33,29.11 Q1.3
  Top 0.254: 7.26,27.93 R4.1 7.89,27.97 8.23,28.3 8.23,29.11 | U2.23 v58.83,9.01 58.53,9.01 56.45,6.93 | 56.45,6.93 54.36,4.83 51.56,4.83 50.98,4.25 J2.7 | v56.44,6.94 56.55,6.93 56.45,6.93 | R1.2 7.84,29.5 8.23,29.11 | 8.23,29.11 Q1.3 | LED1.3-DIN v51.82,15.27
  Bottom 0.254: v56.44,6.94 45.39,6.94 39.09,13.21 17.27,13.21 16.36,14.13 16.36,16.74 15.75,17.35 15.75,19.18 16.51,19.94 16.51,23.88 16.26,24.14 15.49,24.14 v15.26,24.36 | v58.83,9.01 59.22,9.01 59.44,9.23 59.44,12.71 57.83,14.32 54.83,14.32 SJ1.1 SJ1.2 51.99,14.36 51.82,14.53 v51.82,15.27
IO10  (via drill 0.3)
  Top 0.2: v35.76,22.46 35.76,24.97 36.83,26.04 46.48,26.04 46.99,26.55 46.99,27.69 | R14.1 34.86,16.25 v35.76,17.15
  Top 0.254: U2.16 59.31,14.61 58.93,14.99 58.93,21.34 52.58,27.69 46.99,27.69 46.23,27.69 45.9,28.02 J1.9
  Bottom 0.2: v35.76,17.15 v35.76,22.46
IO18
  Top 0.254: U2.26 63.47,5.46 63.25,5.24 60.93,5.24 60.48,5.7 60.48,6.46 59.41,7.52 58.45,7.52 55.63,4.7 55.63,4.11 J2.6
IO19
  Top 0.254: J2.5 56.06,4.51 58.67,7.12 59.18,7.12 60.07,6.23 60.07,5.47 60.71,4.83 63.5,4.83 64.26,5.59 U2.27
LEDRX
  Top 0.61: U4.GPIO2 25.42,26.95 25.98,27.51 R20.1
LEDRXOK
  Top 0.61: U4.GPIO0 22.58,23.19 R22.1
LEDSFD
  Top 0.61: U4.GPIO1 24.02,26.79 23.44,27.36 R21.1
LEDTX
  Top 0.61: U4.GPIO3 26.82,25.8 R19.1
N$1
  Top 0.61: R19.2 30.49,25.83 D3.A
N$2
  Top 0.254: R12.2 13.97,23.12 13.21,22.36 LED2.A
N$3
  Top 0.254: LED2.C 13.21,19.82 13.46,19.56 14.66,19.56 14.78,19.44 14.78,17.15 14.65,17.02 U3.19
N$4
  Top 0.254: LED3.A 14.24,21.85 R13.2
N$5
  Top 0.254: D2.C R2.2
N$6
  Top 0.254: U3.18 14.78,16.52 15.29,17.02 15.29,20.07 15.03,20.34 LED3.C
N$8
  Top 0.254: U3.9 10.68,13.71 11.05,13.34 14.1,13.34 14.35,13.09 R16.1
N$10
  Top 0.254: U4.EXTON 37.21,10.55 37.83,11.17 R17.2
N$11
  Top 0.254: U4.WAKEUP 35.79,11.95 36.42,12.58 36.42,12.88
  Top 0.406: 36.42,12.88 R15.2
N$12
  Top 0.254: U4.RST 34.86,13.35
  Top 0.406: 34.86,13.35 R14.2
N$13
  Top 0.2: Q2.1 11.2,24.17 11.43,23.93 13.21,23.93 14.1,24.82 14.1,27.95 13.83,28.21 R6.1
N$14
  Top 0.2: R5.1 13.43,24.85 13.59,25.01 13.59,27.18 13.36,27.41 12.03,27.41 Q1.1
N$15
  Top 0.254: SW2.2 4.15,26.51 4.32,26.68 4.32,29.22 4.6,29.5 R1.1
N$16
  Top 0.61: R20.2 30.55,27.5 D4.A
N$17
  Top 0.61: D5.A 20.89,27.35 R21.2
N$18
  Top 0.61: D6.A 20.75,25.51 R22.2
RESET  (via drill 0.3)
  Top 0.2: v14.68,27.82 14.61,27.72 14.61,24.62 13.46,23.48 9.32,23.48 9.16,23.48
  Top 0.254: 7.27,26.17 R3.1 7.89,26.15 8.28,25.76 | 9.17,25.56 Q2.3 | U2.8 65.07,20.28 62.99,22.36 61.47,22.36 61.14,22.68 v61.14,23.37 J1.3 | 8.28,25.76 Q2.3 | 8.28,25.76 8.25,25.74 8.25,25.1 7.9,24.75 C7.1 | Q2.3 9.16,23.48 9.16,23.39 6.86,21.09 v3.05,21.09 | v2.67,11.18 SW1.2
  Bottom 0.254: v14.68,27.82 19.91,27.82 24.38,23.35 61.12,23.35 v61.14,23.37 | v3.05,21.09 3.05,18.29 2.29,17.53 2.29,14.48 3.05,13.72 3.05,11.56 v2.67,11.18
RTS  (via drill 0.3)
  Top 0.2: R5.2 12.06,26.55 11.9,26.71 Q2.2
  Top 0.254: U3.24 12.19,20.29 11.14,21.34 v10.03,21.34 | v9.91,27.69 10.29,27.31 10.29,26.93 10.5,26.71 Q2.2
  Bottom 0.254: v10.03,21.34 10.29,21.6 10.29,27.31 v9.91,27.69
RXD  (via drill 0.3)
  Top 0.254: v59.44,5.85 59.44,5.24 60.86,3.82 61.14,3.82 | U2.30 66.68,6.53 66.37,6.23 65.15,6.23 64.77,5.85 64.77,5.34 63.25,3.82 61.14,3.82 | J2.3 61.14,3.82 | U3.26 11.18,19.5 v10.79,19.89
  Bottom 0.254: v59.44,5.85 59.36,5.77 44.91,5.77 38.41,12.27 16.76,12.27 15.32,13.72 15.32,16.36 12.85,18.8 11.89,18.8 v10.79,19.89
TXD  (via drill 0.3)
  Top 0.254: U2.31 v67.47,5.72 | J2.4 58.63,6.23 v58.88,6.48 | U3.25 11.68,19.94 v11.56,20.07
  Bottom 0.254: v67.47,5.72 60.58,5.72 59.69,6.61 59.01,6.61 v58.88,6.48 58.65,6.25 45.14,6.25 38.63,12.76 16.97,12.76 15.8,13.92 15.8,16.59 13.08,19.31 12.32,19.31 v11.56,20.07
VBUS  (via drill 0.3, 0.4)
  Top 0.254: U3.8 10.18,13.75 9.78,13.34 9.27,13.34 v7.87,11.94 | J3.1 4.48,17.28 5.84,17.28
  other vias: 6.7,17.62 7.11,11.94 6.35,11.94
  pour Bottom (rank 2): 7.62,12.71 7.62,18.29 6.1,18.29 6.1,11.44 8.25,11.44 8.25,12.71
  pour Top (rank 2): 4.06,17.1 7.37,17.1 7.37,18.04 4.06,18.04
  pour Top (rank 2): 7.62,8.13 7.62,11.18 8.25,11.82 8.25,12.32 6.1,12.32 6.1,7.63 7.11,7.63
VDD5V  (via drill 0.3, 0.4)  (2 unrouted)
  Top 0.254: LED1.4-VDD 55.91,15.72 56.13,15.5 v56.13,14.92 | v56.13,14.92
  Top 1.016: v13.44,8.78 9.81,8.78 8.87,7.83 U1.1 6.67,5.03 | D1.- 6.67,5.03 | 5.03,5.03 6.67,5.03
  Bottom 0.406: v56.13,14.92 57.99,14.92 59.94,12.96 59.94,7.07 60.78,6.23 67.03,6.23 67.18,6.38 67.74,6.38 68.15,5.97 68.15,5.47 66.22,3.54 66.22,3.12
  Bottom 1.016: J2.1 66.22,3.12 65.08,4.27 45.01,4.27 38,11.28 15.94,11.28 v13.44,8.78

### Text on the board
tPlace: GND | GND | 3V3 | 3V3 | IO10 | IO0 | IO1 | IO2 | IO3 | GND | RST | GND | 3V3 | ESP32-C3 UWB v1.0 | evilscientress/ESP32-C3-UWB | IO4/MOSI | IO5/MISO | IO6/SCLK | IO7/INT | IO8/CS | IO9/BOOT | IO18/D- | IO19/D+ | TXD | RXD | GND | 5V0
bPlace: GND | GND | GND | GND | GND | GND | GND | GND | GND | 3V3 | 3V3 | IO10 | IO0 | IO1 | IO2 | IO3 | GND | RST | GND | 3V3 | IO4/MOSI | IO5/MISO | IO6/SCLK | IO7/INT | IO8/CS | IO9/BOOT | IO18/D- | IO19/D+ | TXD | RXD | GND | 5V0